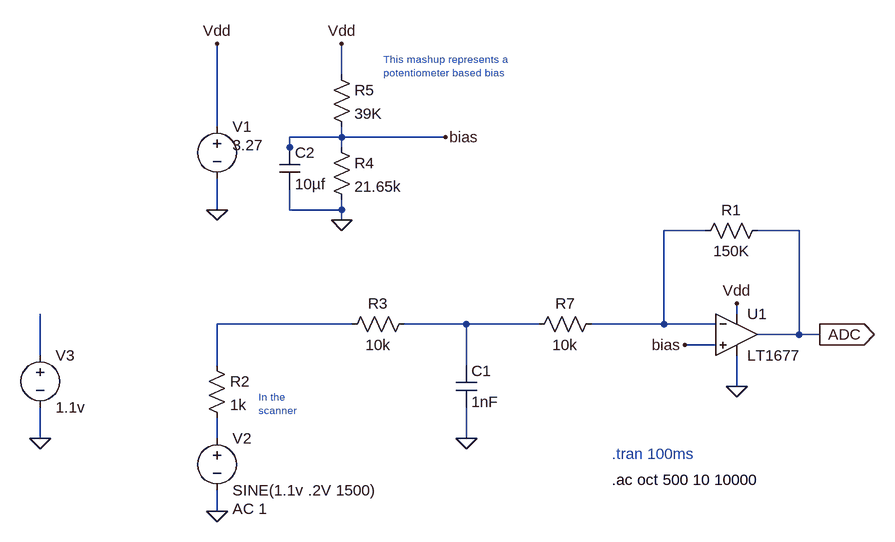
[diagram p0: schematic pico_dev_meter.asc]
pico_dev_meter.asc, the LTspice schematic file:
Version 4.1
SHEET 1 880 680
WIRE -464 -240 -464 -288
WIRE -656 -160 -656 -288
WIRE -464 -144 -464 -160
WIRE -464 -144 -544 -144
WIRE -304 -144 -464 -144
WIRE -544 -128 -544 -144
WIRE -464 -128 -464 -144
WIRE -544 -112 -544 -128
WIRE -656 -32 -656 -80
WIRE -544 -32 -544 -64
WIRE -464 -32 -464 -48
WIRE -464 -32 -544 -32
WIRE -464 -16 -464 -32
WIRE 96 0 32 0
WIRE 240 0 176 0
WIRE 144 128 144 112
WIRE -448 144 -656 144
WIRE -272 144 -368 144
WIRE -160 144 -272 144
WIRE 32 144 32 0
WIRE 32 144 -80 144
WIRE 112 144 32 144
WIRE 240 160 240 0
WIRE 240 160 176 160
WIRE 272 160 240 160
WIRE 112 176 64 176
WIRE -928 192 -928 128
WIRE -656 208 -656 144
WIRE -272 208 -272 144
WIRE 144 240 144 192
WIRE -928 320 -928 272
WIRE -656 320 -656 288
WIRE -272 320 -272 272
WIRE -656 432 -656 400
FLAG -272 320 0
FLAG 144 240 0
FLAG -656 -32 0
FLAG -656 -288 Vdd
FLAG 144 112 Vdd
FLAG -464 -16 0
FLAG -464 -288 Vdd
FLAG -304 -144 bias
FLAG 64 176 bias
FLAG -656 432 0
FLAG 272 160 ADC
IOPIN 272 160 Out
FLAG -928 320 0
SYMBOL OpAmps\\LT1677 144 96 R0
SYMATTR InstName U1
SYMBOL res 192 -16 R90
WINDOW 0 0 56 VBottom 2
WINDOW 3 32 56 VTop 2
SYMATTR InstName R1
SYMATTR Value 150K
SYMBOL res -352 128 R90
WINDOW 0 0 56 VBottom 2
WINDOW 3 32 56 VTop 2
SYMATTR InstName R3
SYMATTR Value 10k
SYMBOL cap -288 208 R0
SYMATTR InstName C1
SYMATTR Value 1nF
SYMBOL voltage -656 -176 R0
WINDOW 3 24 44 Left 2
WINDOW 123 0 0 Left 0
WINDOW 39 0 0 Left 0
SYMATTR Value 3.27
SYMATTR InstName V1
SYMBOL res -480 -144 R0
SYMATTR InstName R4
SYMATTR Value 21.65k
SYMBOL res -480 -256 R0
SYMATTR InstName R5
SYMATTR Value 39K
SYMBOL voltage -656 304 R0
WINDOW 123 24 124 Left 2
WINDOW 39 0 0 Left 0
SYMATTR Value2 AC 1
SYMATTR InstName V2
SYMATTR Value SINE(1.1v .2V 1500)
SYMBOL cap -560 -128 R0
SYMATTR InstName C2
SYMATTR Value 10µf
SYMBOL voltage -928 176 R0
WINDOW 123 0 0 Left 0
WINDOW 39 0 0 Left 0
SYMATTR InstName V3
SYMATTR Value 1.1v
SYMBOL res -672 192 R0
SYMATTR InstName R2
SYMATTR Value 1k
SYMBOL res -64 128 R90
WINDOW 0 0 56 VBottom 2
WINDOW 3 32 56 VTop 2
SYMATTR InstName R7
SYMATTR Value 10k
TEXT -48 344 Left 2 ;.tran 100ms
TEXT -48 384 Left 2 !.ac oct 500 10 10000
TEXT -400 -264 Left 1 ;This mashup represents a\npotentiometer based bias
TEXT -592 256 Left 1 ;In the\nscanner

The netlist it stands for:
* pico_dev_meter.asc
X§U1 bias N001 Vdd 0 ADC LT1677  ; pins In+ In- V+ V- OUT
R1 ADC N001 150K
R3 N003 N002 10k
C1 N003 0 1nF
V1 Vdd 0 3.27
R4 bias 0 21.65k
R5 Vdd bias 39K
V2 N005 0 SINE(1.1v .2V 1500) AC 1
C2 bias 0 10µf
V3 N004 0 1.1v
R2 N002 N005 1k
R7 N001 N003 10k
* .tran 100ms
.ac oct 500 10 10000
* This mashup represents a
* potentiometer based bias
* In the
* scanner
.lib LTC.lib
.backanno
.end